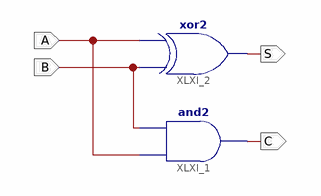
[diagram p0: schematic sheet 1]
// Xilinx ISE schematic halfadder.sch (spartan3) as structural Verilog: 2 symbols, 4 ports
module halfadder (
  input  B,
  input  A,
  output S,
  output C
);

  and XLXI_1 (C, A, B);
  xor XLXI_2 (S, B, A);
endmodule
